# Altium schematic sheet CAN.SchDoc
size A4; SheetNumber: 3; SheetTotal: 3
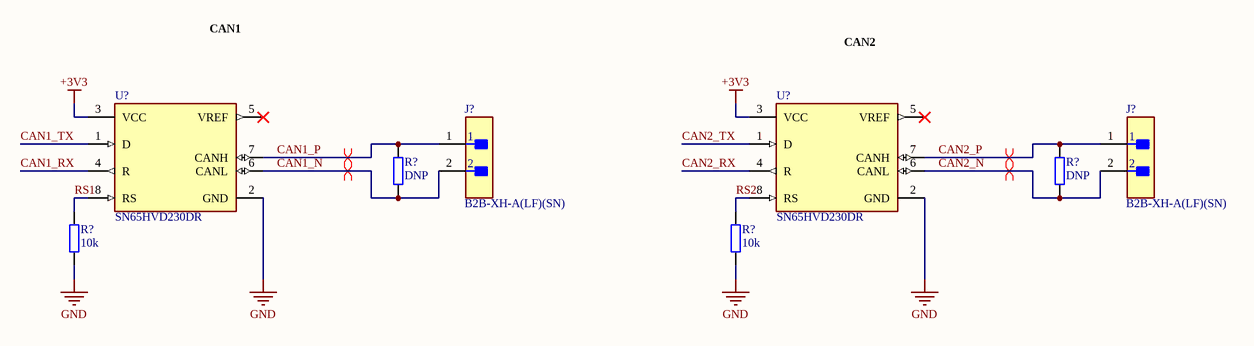
[diagram p0: CAN.SchDoc]

## Parts
(Parts that share a designator on the sheet are numbered #1, #2 ... from top to bottom, then left to right.)
J?#1  B2B-XH-A(LF)(SN)  [FP-B2B-XH-A_LF_SN-MFG]
J?#2  B2B-XH-A(LF)(SN)  [FP-B2B-XH-A_LF_SN-MFG]
R?#1  DNP
R?#2  DNP
R?#3  10k
R?#4  10k
U?#1  SN65HVD230DR  [FP-D0008A-IPC_A]
U?#2  SN65HVD230DR  [FP-D0008A-IPC_A]

## Nets
+3V3: U?#1.3(VCC) U?#2.3(VCC)
GND: R?#3.1 R?#4.1 U?#1.2(GND) U?#2.2(GND)
CAN1_N: J?#1.2 R?#1.1 U?#1.6(CANL)
CAN1_P: J?#1.1 R?#1.2 U?#1.7(CANH)
CAN1_RX: U?#1.4(R)
CAN1_TX: U?#1.1(D)
CAN2_N: J?#2.2 R?#2.1 U?#2.6(CANL)
CAN2_P: J?#2.1 R?#2.2 U?#2.7(CANH)
CAN2_RX: U?#2.4(R)
CAN2_TX: U?#2.1(D)
RS1: R?#3.2 U?#1.8(RS)
RS2: R?#4.2 U?#2.8(RS)

Not connected (* = marked no-connect by the designer): U?#1 5(VREF)*; U?#2 5(VREF)*

## Layout directives
differential pair: CAN1_N, CAN1_P, CAN2_N, CAN2_P

## Notes on the sheet
- CAN1
- CAN2

## Library data of the parts
J?#1 J?#2 = CMP-2000-05888-3: CONN HEADER VERT 2POS 2.5MM; Current Rating: 3A; Voltage Rating: 250V; Number of Contacts: 2; Contact Resistance: 20mR; Wire/Cable Gauge: 22AWG; Insulation Resistance: 1GR; Connector Type: Male Pin; Packaging: Bulk; Contact Material: Brass; Lead Free: Lead Free; Orientation: Straight; Contact Plating: Tin; Max Current Rating: 3A; Termination: Solder; Fastening Type: Detent; Depth: 5.75mm; Housing Material: Polyamide; REACH SVHC: No SVHC; Series: XH; Voltage Rating (AC): 250V; Number of Positions: 2; Color: Natural; Contact Type: Male Pin; Max Voltage Rating (DC): 250V; Pitch: 2.5mm; Lead Pitch: 2.5mm; Mount: Through Hole; Max Operating Temperature: 85°C; Length: 7.4mm; Max Voltage Rating (AC): 250V; Min Operating Temperature: -25°C; Number of Rows: 1; Housing Color: White
R?#1 R?#2 = RES_0805: Resistor SMD 0805; Manufacturer: *; Mfg Part #: *; Distrubutor Link: *
R?#3 R?#4 = RES_0402: Resistor SMD 0402; Manufacturer: *; Mfg Part #: *; Distrubutor Link: *
U?#1 U?#2 = CMP-0315-00015-3: IC TRANSCEIVER HALF 1/1 8SOIC; Number of Transceivers: 1; Operating Supply Voltage: 3.3V; Number of I/Os: 2; Max Supply Current: 17mA; Max Supply Voltage: 3.6V; Min Supply Voltage: 3V; Data Rate: 1Mbps; Min Operating Temperature: -40°C; Packaging: Tape and Reel; Lead Free: Lead Free; Number of Transmit Buffers: 1; Max Operating Temperature: 85°C; Number of Receive Buffers: 1; Number of Pins: 8; Package Quantity: 1; Radiation Hardening: No; Case/Package: D; REACH SVHC: No SVHC; Weight: 0.002561oz; Termination: SMD/SMT; Contact Plating: Gold; Nominal Supply Current: 17mA; Number of Receivers: 1; Number of Drivers: 1